# Altium schematic sheet RFM69HCW_Arduino_Schematic.schdoc
size 188 x 198 mm
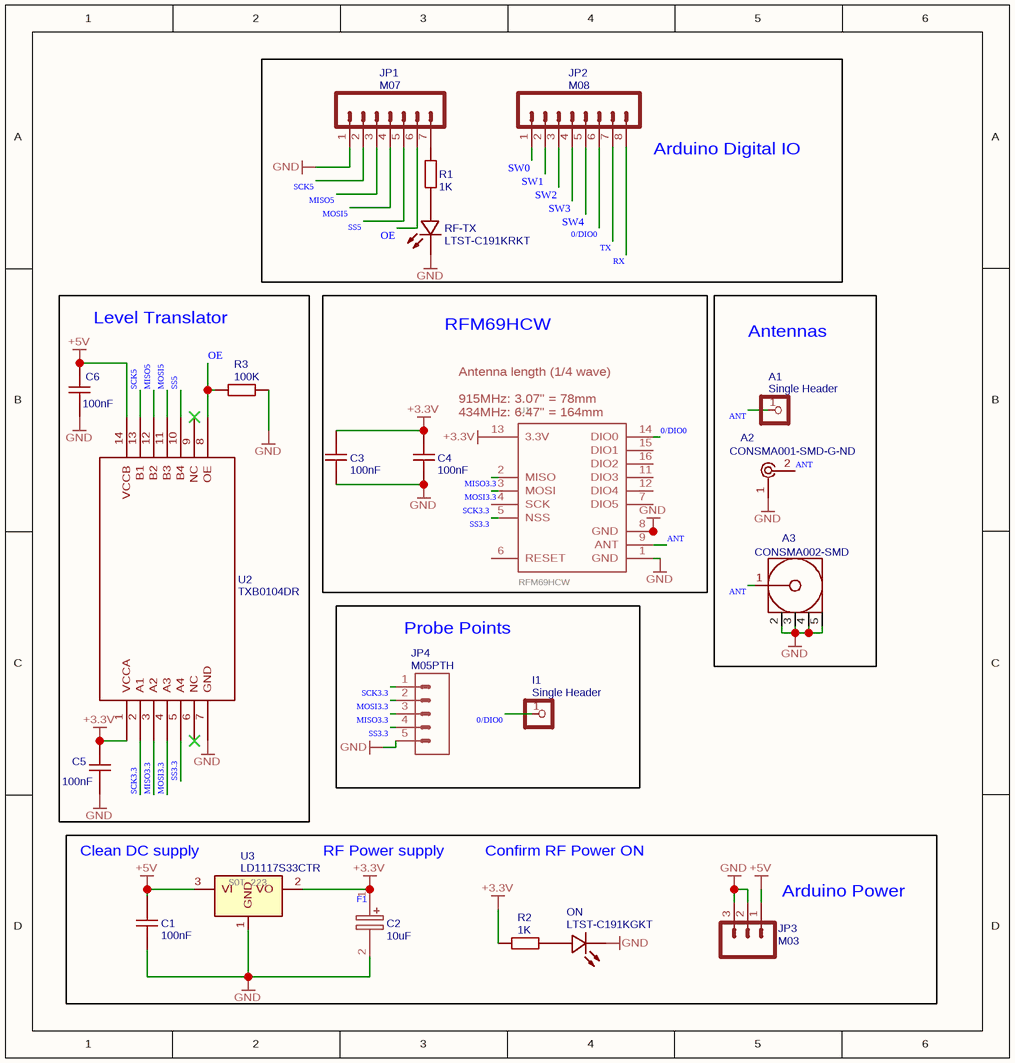
[diagram p0: RFM69HCW_Arduino_Schematic.schdoc]

## Parts
A1  Single Header  [M1X1]
A2  CONSMA001-SMD-G-ND  [RF_SMA_RECEPTICAL_VERTICAL_CONSMA001-SMD-G]
A3  CONSMA002-SMD  [CON-SMA-SMD-RA]
C1  100nF  [C0603]
C2  10uF  [UWT(4X5.4)]
C3  100nF  [C0603]
C4  100nF  [C0603]
C5  100nF  [C0603]
C6  100nF  [C0603]
I1  Single Header  [M1X1]
JP1  M07  [1X07]
JP2  M08  [1X08]
JP3  M03  [1X03]
JP4  M05PTH  [1X05]
ON  LTST-C191KGKT  [LED0603-RD]
R1  1K  [R0603]
R2  1K  [R0603]
R3  100K  [R0603]
RF-TX  LTST-C191KRKT  [LED0603-RD]
U1  RFM69HCW  [RFM69HCW-XXXS2]
U2  TXB0104DR  [D14_TEX]
U3  LD1117S33CTR  [SOT-223]

## Blocks framed on the sheet
Arduino Digital IO: JP1 JP2 R1 RF-TX
Level Translator: C5 C6 R3 U2
RFM69HCW: C3 C4 U1
Antennas: A1-A3
Probe Points: I1 JP4
Arduino Power: C1 C2 JP3 ON R2 U3

## Nets
+3.3V: C2.1(+) C3.1 C4.1 C5.2 R2.1 U1.13(3.3V) U2.1(VCCA) U3.2(VO)
+5V: C1.2 C6.1 JP3.1 U2.14(VCCB) U3.3(VI)
GND: A2.1 A3.2(GND) A3.3(GND) A3.4(GND) A3.5(GND) C1.1 C2.2(-) C3.2 C4.2 C5.1 C6.2 JP1.1 JP3.2 JP3.3 JP4.5 ON.1(-) R3.1 RF-TX.1(-) U1.1(GND) U1.8(GND) U1.10(GND) U2.7(GND) U3.1(GND)
0/DIO0: I1.1 JP2.6 U1.14(DIO0)
ANT: A1.1 A2.2 A3.1(Signal) U1.9(ANT)
MISO3.3: JP4.3 U1.2(MISO) U2.3(A2)
MISO5: JP1.3 U2.12(B2)
MOSI3.3: JP4.2 U1.3(MOSI) U2.4(A3)
MOSI5: JP1.4 U2.11(B3)
OE: JP1.6 R3.2 U2.8(OE)
RX: JP2.8
SCK3.3: JP4.1 U1.4(SCK) U2.2(A1)
SCK5: JP1.2 U2.13(B1)
SS3.3: JP4.4 U1.5(NSS) U2.5(A4)
SS5: JP1.5 U2.10(B4)
SW0: JP2.1
SW1: JP2.2
SW2: JP2.3
SW3: JP2.4
SW4: JP2.5
TX: JP2.7
NetJP1_7: JP1.7 R1.1
NetON_2: ON.2(+) R2.2
NetR1_2: R1.2 RF-TX.2(+)

Not connected (* = marked no-connect by the designer): U1 6(RESET) 7(DIO5) 11(DIO3) 12(DIO4) 15(DIO1) 16(DIO2); U2 6(NC)* 9(NC)*

## Notes on the sheet
- (near U1) Antenna length (1/4 wave)
  915MHz: 3.07" = 78mm
  434MHz: 6.47" = 164mm
- Clean DC supply
- RF Power supply
- Confirm RF Power ON
- (near C2) F1
- (in symbol LD1117S33CTR) SOT-223

## Library data of the parts
A1 I1 = Single Header: Contributor: DangerousPrototype; spicePre: J; spiceSymbolName: CON_HEADER_1X01
A2 = CONSMA001-SMD-G-ND: Contributor: Ron Childress; spicePre: J; spiceSymbolName: CONSMA001-SMD-G-ND
A3 = CONSMA002-SMD: description: SMA Female Right Angle Surface Mount Connector; spicePre: J; spiceSymbolName: CONSMA002-SMD
C1 C3-C6 = 100nF: BOM_Manufacturer: KEMET; BOM_Manufacturer Part: C0603C104M5RAC7867; nameAlias: Capacitance; Contributor: LCSC; BOM_Supplier: LCSC; BOM_Supplier Part: C599655; spicePre: C; spiceSymbolName: C0603C104M5RAC7867_C599655
C2 = 10uF: Contributor: tmanabc123; spicePre: C; spiceSymbolName: UWT1C100MCL1GB
JP1 = M07: Contributor: SparkFun; spicePre: J; spiceSymbolName: M07
JP2 = M08: Contributor: SparkFun; spicePre: J; spiceSymbolName: M08
JP3 = M03: Contributor: SparkFun; spicePre: J; spiceSymbolName: M03
JP4 = M05PTH: Contributor: Utsav Trivedi; spicePre: J; spiceSymbolName: M05PTH
ON = LTST-C191KGKT: BOM_Manufacturer: LITEON; Contributor: LCSC; BOM_Supplier: LCSC; BOM_Manufacturer Part: LTST-C191KGKT; BOM_Supplier Part: C125098; spicePre: L; spiceSymbolName: LTST-C191KGKT
R1 R2 = 1K: BOM_Manufacturer: PANASONIC; BOM_Manufacturer Part: ERJ-3EKF1001V; nameAlias: Resistance (Ohms); Contributor: LCSC; BOM_Supplier: LCSC; BOM_Supplier Part: C118155; spicePre: R; spiceSymbolName: ERJ-3EKF1001V
R3 = 100K: BOM_Manufacturer: YAGEO; BOM_Manufacturer Part: v; nameAlias: Resistance (Ohms); Contributor: LCSC; BOM_Supplier: LCSC; BOM_Supplier Part: C14675; spicePre: R; spiceSymbolName: RC0603FR-07100KL
RF-TX = LTST-C191KRKT: BOM_Manufacturer: LITEON; Contributor: LCSC; SMT Type: Extend; BOM_Supplier: LCSC; BOM_Manufacturer Part: LTST-C191KRKT; BOM_Supplier Part: C125099; BOM_JLCPCB SMD: Yes; spicePre: L; spiceSymbolName: LTST-C191KRKT
U2 = TXB0104DR: Contributor: Utsav Trivedi; spicePre: U; spiceSymbolName: TXB0104DR
U3 = LD1117S33CTR: Contributor: Philip Dale; spicePre: U; spiceSymbolName: LD1117S33CTR